# EasyEDA Pro project bitMan_2025-12-16.epro

# Schematic Top
Board Name: Board1; Create Date: 2025-11-07; Page Name: Top; Project Name: BitTree; Schematic Name: Top; Update Date: 2025-11-18; Company: bitaggregat.de; Drawn: TR; Page Size: A4; Reviewed: TR; Version: V1.0
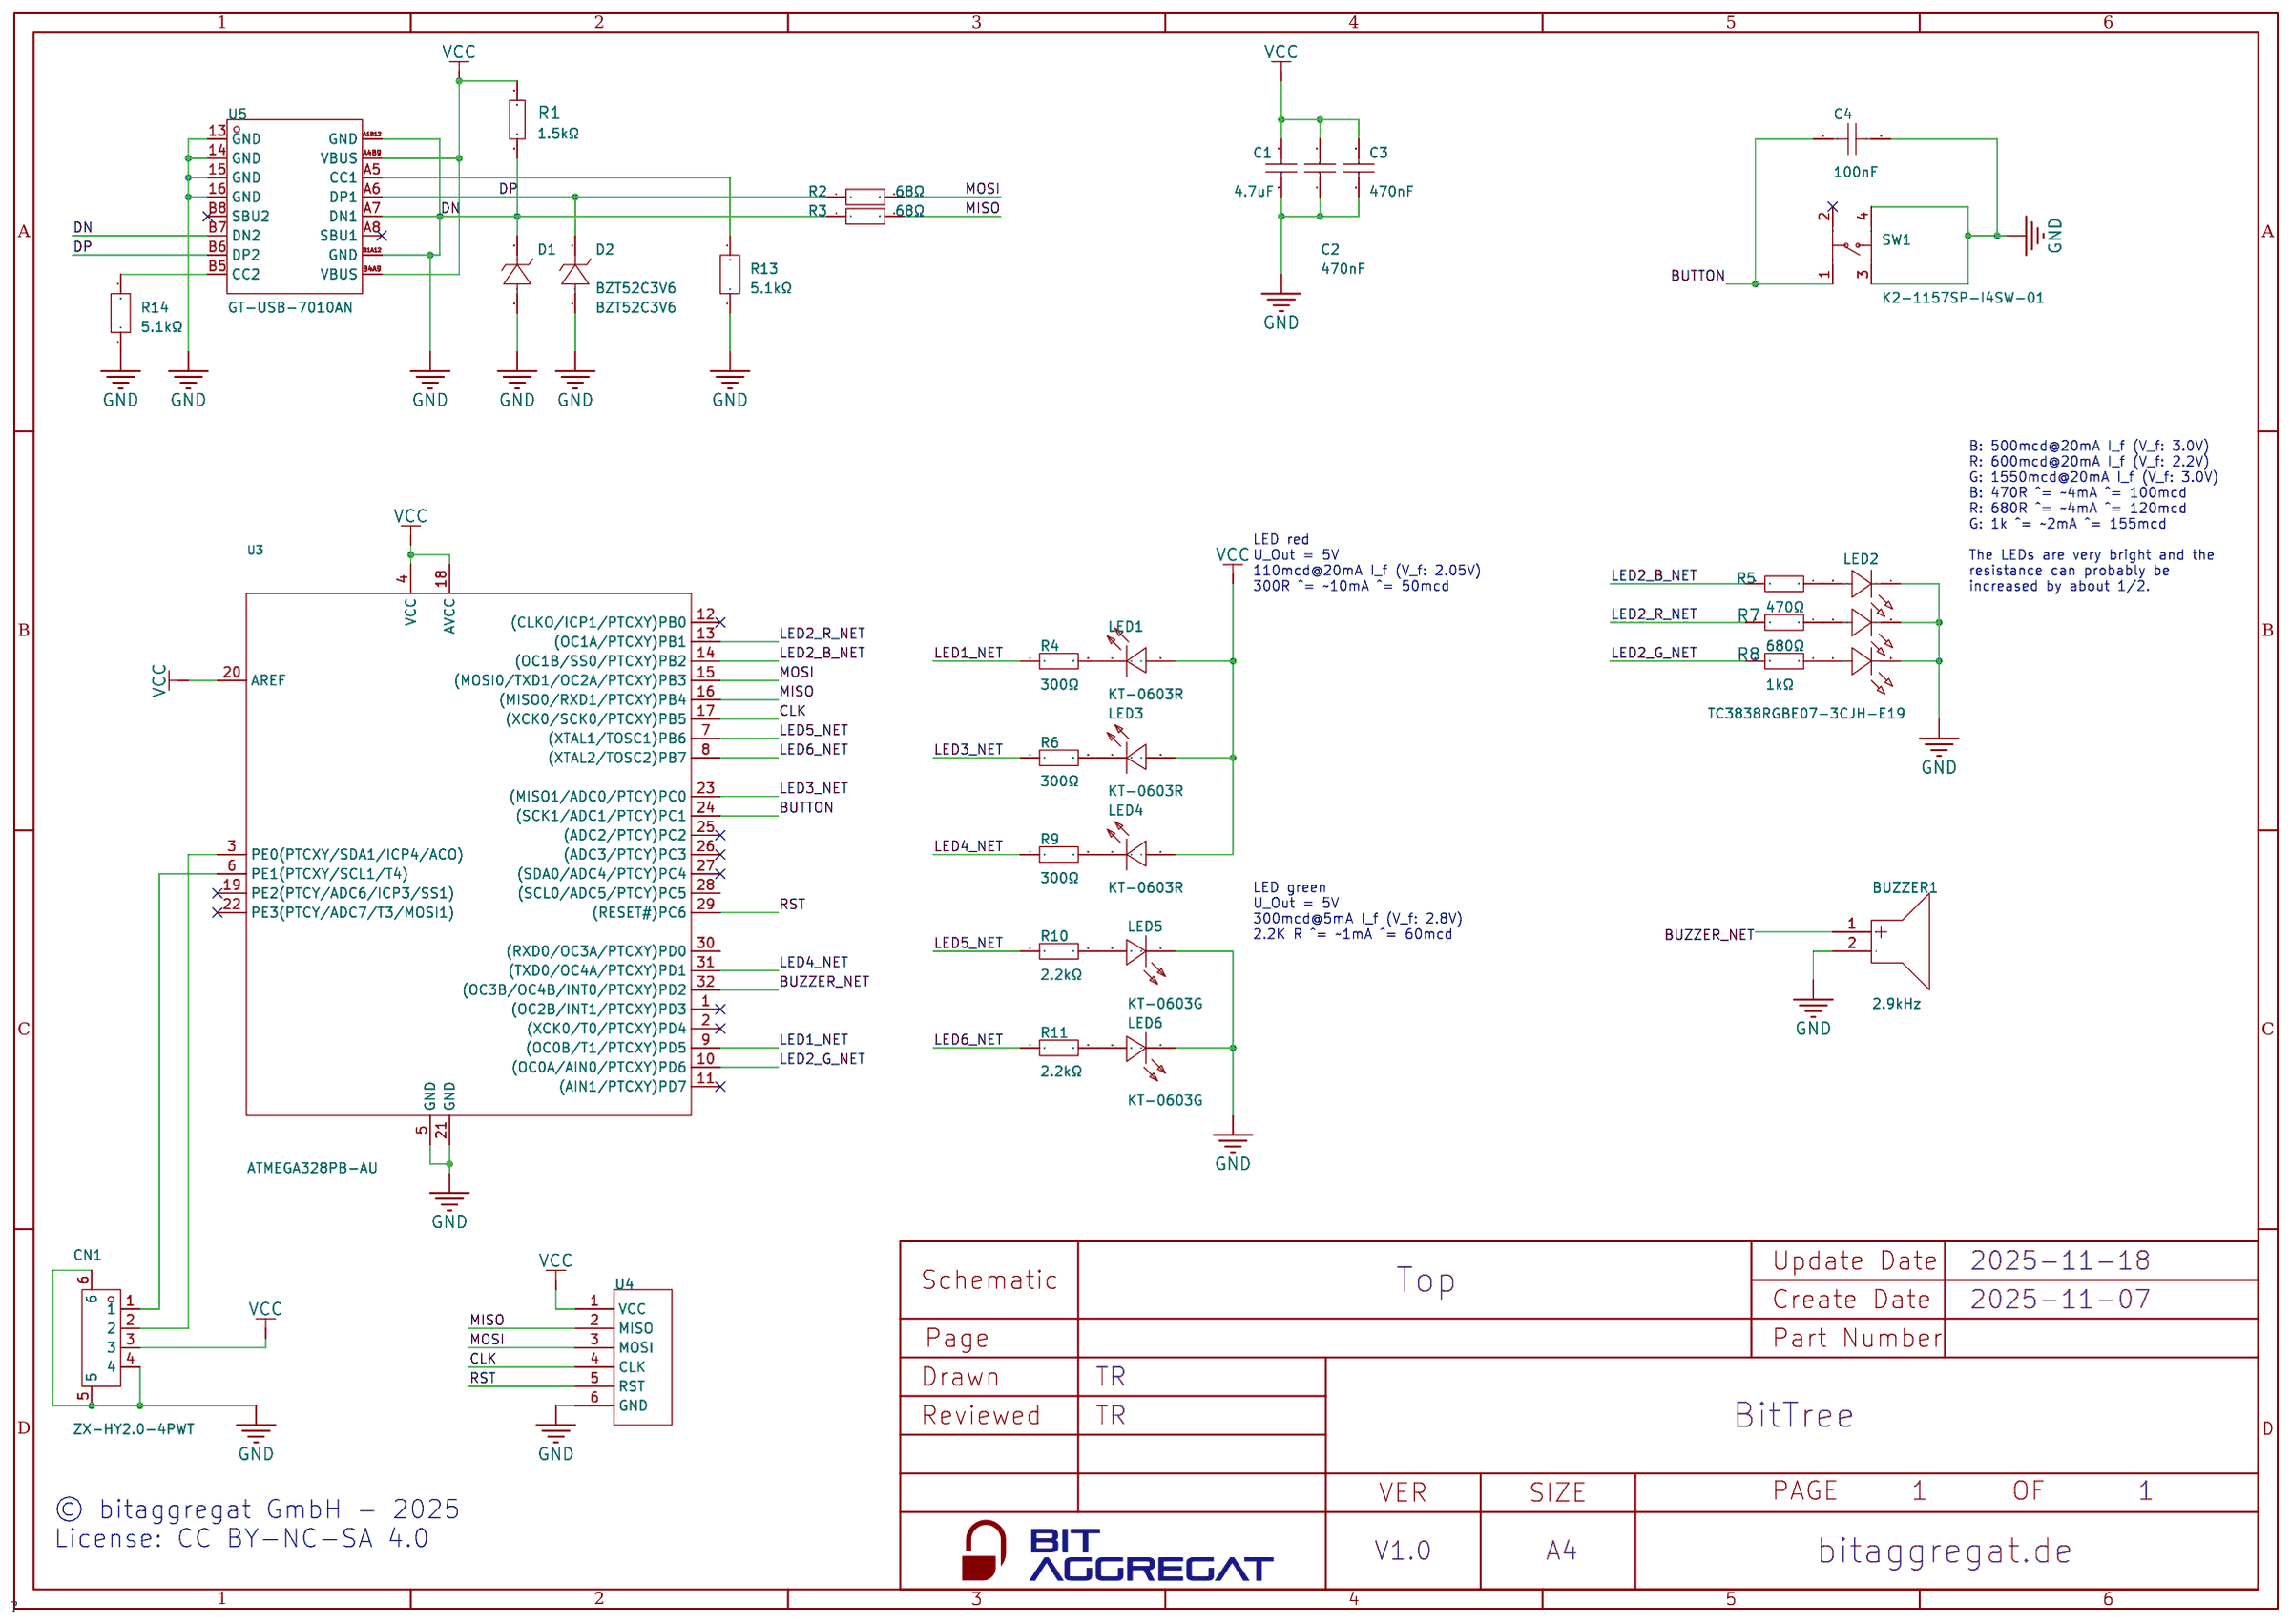
[diagram p0: schematic sheet]

## Parts
BUZZER1  2.9kHz  [BUZ-TH_BD9.0-P5.00-D0.6-L-FD]
C1  4.7uF  [C0603]
C2  470nF  [C0603]
C3  470nF  [C0603]
C4  100nF  [C0603]
CN1  ZX-HY2.0-4PWT  [CONN-SMD_4P-P2.00_ZX-HY2.0-4PWT]
D1  BZT52C3V6  [SOD-123_L2.7-W1.6-LS3.7-RD]
D2  BZT52C3V6  [SOD-123_L2.7-W1.6-LS3.7-RD]
LED1  KT-0603R  [LED0603-RD]
LED2  TC3838RGBE07-3CJH-E19  [LED-SMD_6P-L3.5-W3.5-BL]
LED3  KT-0603R  [LED0603-RD]
LED4  KT-0603R  [LED0603-RD]
LED5  KT-0603G  [LED0603-RD]
LED6  KT-0603G  [LED0603-RD]
R1  1.5kΩ  [R0603]
R2  68Ω  [R0603]
R3  68Ω  [R0603]
R4  300Ω  [R0603]
R5  470Ω  [R0603]
R6  300Ω  [R0603]
R7  680Ω  [R0603]
R8  1kΩ  [R0603]
R9  300Ω  [R0603]
R10  2.2kΩ  [R0603]
R11  2.2kΩ  [R0603]
R13  5.1kΩ  [R0603]
R14  5.1kΩ  [R0603]
SW1  K2-1157SP-I4SW-01  [SW-SMD_4P-L6.2-W6.2-P4.50-LS8.6]
U3  ATMEGA328PB-AU  [TQFP-32_L7.0-W7.0-P0.80-LS9.0-BL]
U4  -  [ProgrammingHeader]  (no BOM)
U5  GT-USB-7010AN  [USB-SMD_GT-USB-7010AN]

## Library data of the parts
BUZZER1 = Cy-9055-5029: Oscillator Circuit:有源(内含驱动线路) Technology Type:电磁式 Operating Voltage:4V~7V Operating Voltage:4V~7V Frequency:2.9kHz Sound Pressure Level (SPL):85dB@5V,10cm Diameter (φD):9mm Height:6mm; LCSC Part Name: 电磁式有源蜂鸣器; Supplier Part: C200211; Manufacturer: CY(超音); Supplier Footprint: 插件,D=9mm; JLCPCB Part Class: Extended Part; Datasheet: https://atta.szlcsc.com/upload/public/pdf/source/20180420/C200211_A81316451996AD52A4D9A06CCBA2DFC8.pdf; Supplier: LCSC; Oscillator Circuit: 有源(内含驱动线路); Technology Type: 电磁式; Operating Voltage: 4V~7V; Sound Pressure Level (SPL): 85dB@5V,10cm; Diameter (φD): 9mm; Height: 6mm
C1 = CL10A475KO8NNNC: Capacitance: Tolerance:±10% Tolerance:±10% Voltage Rated: Temperature Coefficient:; LCSC Part Name: 4.7uF ±10% 16V; Supplier Part: C19666; Manufacturer: SAMSUNG(三星); Supplier Footprint: 0603; JLCPCB Part Class: Basic Part; Datasheet: https://atta.szlcsc.com/upload/public/pdf/source/20160218/1457707763339.pdf; Supplier: LCSC; Tolerance: ±10%
C2 C3 = CL10B474KA8NNNC: Capacitance: Tolerance:±10% Tolerance:±10% Voltage Rated: Temperature Coefficient:; LCSC Part Name: 470nF ±10% 25V; Supplier Part: C1623; Manufacturer: SAMSUNG(三星); Supplier Footprint: 0603; JLCPCB Part Class: Basic Part; Datasheet: https://atta.szlcsc.com/upload/public/pdf/source/20160218/1457707763339.pdf; Supplier: LCSC; Tolerance: ±10%
C4 = CC0603KRX7R9BB104: Capacitance:100nF Tolerance:±10% Tolerance:±10% Voltage Rating:50V Temperature Coefficient:X7R; LCSC Part Name: 100nF ±10% 50V; Supplier Part: C14663; Manufacturer: YAGEO(国巨); Supplier Footprint: 0603; JLCPCB Part Class: Basic Part; Datasheet: https://item.szlcsc.com/datasheet/CC0603KRX7R9BB104/15331.html; Supplier: LCSC; Tolerance: ±10%; Voltage Rating: 50V; Temperature Coefficient: X7R
CN1 = ZX-HY2.0-4PWT: Pins Structure:1x4P Pitch:2mm Mounting Type:Surface Mount, Right Angle Reference Series:HY Number of Pins:4P Number of Rows:1 Number of PINs Per Row:4 Row Spacing:- Current Rating:2A Contact Material:Brass Contact Plating:Tin Operating Temperature:-25℃~+8; LCSC Part Name: 1x4P 间距:2mm 卧贴 系列:HY; Supplier Part: C7429571; Manufacturer: Megastar(兆星); Supplier Footprint: SMD,P=2mm,卧贴; JLCPCB Part Class: Extended Part; Datasheet: https://item.szlcsc.com/datasheet/ZX-HY2.0-4PWT/8427488.html; Supplier: LCSC; Pins Structure: 1x4P; Pitch: 2mm; Mounting Type: Surface Mount, Right Angle; Reference Series: HY; Number of Pins: 4P; Number of Rows: 1; Number of PINs Per Row: 4; Current Rating: 2A; Contact Material: Brass; Contact Plating: Tin; Operating Temperature: -25℃~+85℃; Supplementary Features: Auxiliary Solder Pin; Color: Beige; Z-Height of the Board: 5.2mm; X-Length of Bottom Edge on Board (Spacing Line): 12mm; Y-Width of Bottom Edge on Board: 10.5mm
D1 D2 = BZT52C3V6_C19077397: Diode Configuration:Independent Zener Voltage(Nom):3.6V Reverse Leakage Current (Ir):5uA@1.0V Zener Voltage(Range):3.42V~3.78V Zener Voltage(Range):3.42V~3.78V Pd - Power Dissipation:350mW Impedance(Zzt):90Ω Impedance(Zzk):600Ω Operating Junction Temperat; LCSC Part Name: 表面贴装齐纳二极管; Supplier Part: C19077397; Manufacturer: R+O(宏嘉诚); Supplier Footprint: SOD-123; JLCPCB Part Class: Extended Part; Datasheet: https://item.szlcsc.com/datasheet/BZT52C3V6/20275482.html; Supplier: LCSC; Diode Configuration: Independent; Zener Voltage (Nom): 3.6V; Reverse Leakage Current (Ir): 5uA@1.0V; Zener Voltage (Range): 3.42V~3.78V; Power Dissipation: 500mW; Zener Impedance (Zzt): 90Ω; Zener Voltage(Nom): 3.6V; Zener Voltage(Range): 3.42V~3.78V; Pd - Power Dissipation: 350mW; Impedance(Zzt): 90Ω; Impedance(Zzk): 600Ω; Operating Junction Temperature Range: -55℃~+150℃
LED1 LED3 LED4 = KT-0603R: Emitted Color:Red Power Dissipation:- Forward Current:- Dominant Wavelength:- Dominant Wavelength:- Peak Wavelength:- Diode Configuration:- Lens Color:- Color Temperature:- Color Temperature:- Viewing Angle:- Mounting Sytle:- Operating Temperature:-40℃~+8; LCSC Part Name: 0603 红灯 高亮; Supplier Part: C2286; Manufacturer: KENTO; Supplier Footprint: 0603; JLCPCB Part Class: Basic Part; Datasheet: https://atta.szlcsc.com/upload/public/pdf/source/20160616/1466072038404.pdf; Supplier: LCSC; Emitted Color: Red; Operating Temperature: -40℃~+85℃
LED2 = TC3838RGBE07-3CJH-E19: LCSC Part Name: RGB三色; Supplier Part: C784547; Manufacturer: TCWIN(天成); Supplier Footprint: SMD3535; JLCPCB Part Class: Extended Part; Datasheet: https://atta.szlcsc.com/upload/public/pdf/source/20230731/32820CE5D5D80E19C372DEF700D68815.pdf; Supplier: LCSC
LED5 LED6 = KT-0603G: Illumination Color:Emerald Green Voltage - Forward(Vf):3.1V Voltage - Forward(Vf):3.1V Power(Watts):100mW Forward Current:5mA Wavelength - Dominant:513nm~528nm Wavelength - Dominant:513nm~528nm Peak Wavelength:525nm Lens Color:Water Clear Luminous Intensi; LCSC Part Name: 0603 翠绿 高亮; Supplier Part: C12624; Manufacturer: KENTO; Supplier Footprint: 0603; JLCPCB Part Class: Extended Part; Datasheet: https://item.szlcsc.com/datasheet/KT-0603G/13258.html; Supplier: LCSC; Illumination Color: Emerald Green; Voltage - Forward(Vf): 3.1V; Power(Watts): 100mW; Forward Current: 5mA; Wavelength - Dominant: 513nm~528nm; Peak Wavelength: 525nm; Lens Color: Water Clear; Luminous Intensity: 430mcd; Viewing Angle: 120°; Operating Temperature: -40℃~+85℃
R1 = 0603WAF1501T5E: Type:Thick Film Resistors Resistance:1.5kΩ Tolerance:±1% Tolerance:±1% Power(Watts): Overload Voltage (Max): Temperature Coefficient:±100ppm/℃ Temperature Coefficient:±100ppm/℃ Operating Temperature Range:-55℃~+155℃ Operating Temperature Range:-55℃~+155℃; LCSC Part Name: 1.5kΩ ±1% 100mW 厚膜电阻; Supplier Part: C22843; Manufacturer: UNI-ROYAL(厚声); Supplier Footprint: 0603; JLCPCB Part Class: Basic Part; Datasheet: https://atta.szlcsc.com/upload/public/pdf/source/20200306/C422600_1E6D84923E4A46A82E41ADD87F860B5C.pdf; Supplier: LCSC; Type: Thick Film Resistors; Tolerance: ±1%; Temperature Coefficient: ±100ppm/℃; Operating Temperature Range: -55℃~+155℃
R2 R3 = 0603WAF680JT5E: Type:Thick Film Resistors Resistance:68Ω Tolerance:±1% Tolerance:±1% Power(Watts): Overload Voltage (Max): Temperature Coefficient:±100ppm/℃ Temperature Coefficient:±100ppm/℃ Operating Temperature Range:-55℃~+155℃ Operating Temperature Range:-55℃~+155℃; LCSC Part Name: 68Ω ±1% 100mW 厚膜电阻; Supplier Part: C27592; Manufacturer: UNI-ROYAL(厚声); Supplier Footprint: 0603; JLCPCB Part Class: Extended Part; Datasheet: https://atta.szlcsc.com/upload/public/pdf/source/20200306/C422600_1E6D84923E4A46A82E41ADD87F860B5C.pdf; Supplier: LCSC; Type: Thick Film Resistors; Tolerance: ±1%; Temperature Coefficient: ±100ppm/℃; Operating Temperature Range: -55℃~+155℃
R4 R6 R9 = 0603WAF3000T5E: Type:Thick Film Resistor Resistance:300Ω Tolerance:±1% Tolerance:±1% Power(Watts):100mW Voltage-Supply(Max):75V Temperature Coefficient:±100ppm/℃ Temperature Coefficient:±100ppm/℃ Operating Temperature:-55℃~+155℃ Operating Temperature:-55℃~+155℃; LCSC Part Name: 300Ω ±1% 100mW 厚膜电阻; Supplier Part: C23025; Manufacturer: UNI-ROYAL(厚声); Supplier Footprint: 0603; JLCPCB Part Class: Basic Part; Datasheet: https://item.szlcsc.com/datasheet/0603WAF3000T5E/23752.html; Supplier: LCSC; Type: Thick Film Resistor; Tolerance: ±1%; Power(Watts): 100mW; Voltage-Supply(Max): 75V; Temperature Coefficient: ±100ppm/℃; Operating Temperature: -55℃~+155℃
R5 = 0603WAF4700T5E: Type:Thick Film Resistors Resistance: Tolerance:±1% Tolerance:±1% Power(Watts): Overload Voltage (Max): Temperature Coefficient:±100ppm/℃ Temperature Coefficient:±100ppm/℃ Operating Temperature Range:-55℃~+155℃ Operating Temperature Range:-55℃~+155℃; LCSC Part Name: 470Ω ±1% 100mW 厚膜电阻; Supplier Part: C23179; Manufacturer: UNI-ROYAL(厚声); Supplier Footprint: 0603; JLCPCB Part Class: Basic Part; Datasheet: https://atta.szlcsc.com/upload/public/pdf/source/20200306/C422600_1E6D84923E4A46A82E41ADD87F860B5C.pdf; Supplier: LCSC; Type: Thick Film Resistors; Tolerance: ±1%; Temperature Coefficient: ±100ppm/℃; Operating Temperature Range: -55℃~+155℃
R7 = 0603WAF6800T5E: Type:Thick Film Resistors Resistance: Tolerance:±1% Tolerance:±1% Power(Watts): Overload Voltage (Max): Temperature Coefficient:±100ppm/℃ Temperature Coefficient:±100ppm/℃ Operating Temperature Range:-55℃~+155℃ Operating Temperature Range:-55℃~+155℃; LCSC Part Name: 680Ω ±1% 100mW 厚膜电阻; Supplier Part: C23228; Manufacturer: UNI-ROYAL(厚声); Supplier Footprint: 0603; JLCPCB Part Class: Basic Part; Datasheet: https://atta.szlcsc.com/upload/public/pdf/source/20200306/C422600_1E6D84923E4A46A82E41ADD87F860B5C.pdf; Supplier: LCSC; Type: Thick Film Resistors; Tolerance: ±1%; Temperature Coefficient: ±100ppm/℃; Operating Temperature Range: -55℃~+155℃
R8 = 0603WAF1001T5E: Type:Thick Film Resistors Resistance:1kΩ Tolerance:±1% Tolerance:±1% Power(Watts): Overload Voltage (Max): Temperature Coefficient:±100ppm/℃ Temperature Coefficient:±100ppm/℃ Operating Temperature Range:-55℃~+155℃ Operating Temperature Range:-55℃~+155℃; LCSC Part Name: 1kΩ ±1% 100mW 厚膜电阻; Supplier Part: C21190; Manufacturer: UNI-ROYAL(厚声); Supplier Footprint: 0603; JLCPCB Part Class: Basic Part; Datasheet: https://atta.szlcsc.com/upload/public/pdf/source/20200306/C422600_1E6D84923E4A46A82E41ADD87F860B5C.pdf; Supplier: LCSC; Type: Thick Film Resistors; Tolerance: ±1%; Temperature Coefficient: ±100ppm/℃; Operating Temperature Range: -55℃~+155℃
R10 R11 = 0603WAF2201T5E_C4190: Type:Thick Film Resistors Resistance:2.2kΩ Tolerance:±1% Tolerance:±1% Power(Watts): Overload Voltage (Max): Temperature Coefficient:±100ppm/℃ Temperature Coefficient:±100ppm/℃ Operating Temperature Range:-55℃~+155℃ Operating Temperature Range:-55℃~+155℃; LCSC Part Name: 2.2kΩ ±1% 100mW 厚膜电阻; Supplier Part: C4190; Manufacturer: UNI-ROYAL(厚声); Manufacturer Part: 0603WAF2201T5E; Supplier Footprint: 0603; JLCPCB Part Class: Basic Part; Datasheet: https://atta.szlcsc.com/upload/public/pdf/source/20200306/C422600_1E6D84923E4A46A82E41ADD87F860B5C.pdf; Supplier: LCSC; Type: Thick Film Resistors; Tolerance: ±1%; Temperature Coefficient: ±100ppm/℃; Operating Temperature Range: -55℃~+155℃
R13 R14 = FRC0603F5101TS: Type:Thick Film Resistor Resistance:5.1kΩ Tolerance:±1% Tolerance:±1% Power(Watts):100mW Voltage-Supply(Max):75V Temperature Coefficient:±100ppm/℃ Temperature Coefficient:±100ppm/℃ Operating Temperature:-55℃~+155℃ Operating Temperature:-55℃~+155℃; LCSC Part Name: 5.1kΩ ±1% 100mW 厚膜电阻; Supplier Part: C2907044; Manufacturer: FOJAN(富捷); Supplier Footprint: 0603; JLCPCB Part Class: Extended Part; Supplier: LCSC; Type: Thick Film Resistor; Tolerance: ±1%; Power(Watts): 100mW; Voltage-Supply(Max): 75V; Temperature Coefficient: ±100ppm/℃; Operating Temperature: -55℃~+155℃
SW1 = K2-1157SP-I4SW-01: Circuit:- Self Lock / No Lock:- Actuator Style:Round Button IP Rating:- Mounting Type:Surface Mount,Vertical Contact Current:50mA Voltage Rating:12V Actuator/Cap Color:Red With Lamp:Without Termination Style:Gull Wing Operating Force:2.5N Operating Temper; LCSC Part Name: 6.4x6.2x3.7红柄开关; Supplier Part: C2909692; Manufacturer: 韩国韩荣; Supplier Footprint: SMD; JLCPCB Part Class: Extended Part; Datasheet: https://item.szlcsc.com/datasheet/K2-1157SP-I4SW-01/3187750.html; Supplier: LCSC; Actuator Style: Round Button; Mounting Type: Surface Mount,Vertical; Contact Current: 50mA; Voltage Rating: 12V; Actuator/Cap Color: Red; With Lamp: Without; Termination Style: Gull Wing; Operating Force: 2.5N; Operating Temperature: -25℃~+80℃; Life: 100,000 Cycles
U3 = ATMEGA328PB-AU: CPU Core:AVR CPU Maximum Speed:20MHz Program Storage Size:32KB Program Memory Type:FLASH Number of I/O:27 ADC (Bit):10bit Voltage - Supply:1.8V~5.5V Voltage - Supply:1.8V~5.5V Applications:-; Supplier Part: C132230; Manufacturer: MICROCHIP(美国微芯); Supplier Footprint: TQFP-32(7x7); JLCPCB Part Class: Extended Part; Datasheet: https://item.szlcsc.com/datasheet/ATMEGA328PB-AU/143529.html; Supplier: LCSC; CPU Core: AVR; CPU Maximum Speed: 20MHz; Program Storage Size: 32KB; Program Memory Type: FLASH; Number of I/O: 27; ADC (Bit): 10bit; Voltage - Supply: 1.8V~5.5V
U4 = ProgrammingHeader
U5 = GT-USB-7010AN: Connector Type:Type-C Standard:USB 2.0 Gender:Female Mounting Style:卧贴 Number of Contacts:16P Number of Ports:1 Current Rating - Power (Max):5A Contact Material:高导铜 Contact Plating:Gold Operating Temperature Range:-40℃~+85℃ Operating Temperature Range:-40; LCSC Part Name: Type-C 母 卧贴 黑色; Supplier Part: C963370; Manufacturer: G-Switch(品赞); Supplier Footprint: SMD; JLCPCB Part Class: Extended Part; Datasheet: https://atta.szlcsc.com/upload/public/pdf/source/20231219/A53A193191E7DF39BB7DE19828A2E6A3.pdf; Supplier: LCSC; Connector Type: Type-C; Standard: USB 2.0; Gender: Female; Mounting Style: 卧贴; Number of Contacts: 16P; Number of Ports: 1; Current Rating - Power (Max): 5A; Contact Material: 高导铜; Contact Plating: Gold; Operating Temperature Range: -40℃~+85℃

## Nets
GND: BUZZER1.2(-) C1.1 C2.1 C3.1 C4.2 CN1.4 CN1.5 CN1.6 D1.2(A) D2.2(A) LED2.4(-) LED2.5(-) LED2.6(-) LED5.1(K) LED6.1(K) R13.1 R14.1 SW1.3 SW1.4 U3.5(GND) U3.21(GND) U4.6(GND) U5.13(GND) U5.14(GND) U5.15(GND) U5.16(GND) U5.A1B12(GND) U5.B1A12(GND)
VCC: C1.2 C2.2 C3.2 CN1.3 LED1.2(A) LED3.2(A) LED4.2(A) R1.2 U3.4(VCC) U3.18(AVCC) U3.20(AREF) U4.1(VCC) U5.A4B9(VBUS) U5.B4A9(VBUS)
BUTTON: C4.1 SW1.1 U3.24((SCK1/ADC1/PTCY)PC1)
BUZZER_NET: BUZZER1.1(+) U3.32((OC3B/OC4B/INT0/PTCXY)PD2)
CLK: U3.17((XCK0/SCK0/PTCXY)PB5) U4.4(CLK)
DN: D1.1(K) R1.1 R3.1 U5.A7(DN1) U5.B7(DN2)
DP: D2.1(K) R2.1 U5.A6(DP1) U5.B6(DP2)
LED1_NET: R4.1 U3.9((OC0B/T1/PTCXY)PD5)
LED2_B_NET: R5.2 U3.14((OC1B/SS0/PTCXY)PB2)
LED2_G_NET: R8.2 U3.10((OC0A/AIN0/PTCXY)PD6)
LED2_R_NET: R7.2 U3.13((OC1A/PTCXY)PB1)
LED3_NET: R6.1 U3.23((MISO1/ADC0/PTCY)PC0)
LED4_NET: R9.1 U3.31((TXD0/OC4A/PTCXY)PD1)
LED5_NET: R10.1 U3.7((XTAL1/TOSC1)PB6)
LED6_NET: R11.1 U3.8((XTAL2/TOSC2)PB7)
MISO: R3.2 U3.16((MISO0/RXD1/PTCXY)PB4) U4.2(MISO)
MOSI: R2.2 U3.15((MOSI0/TXD1/OC2A/PTCXY)PB3) U4.3(MOSI)
RST: U3.29((RESET#)PC6) U4.5(RST)
$1N1666: LED2.2(+) R7.1
$1N1705: LED2.3(+) R5.1
$1N1857: LED2.1(+) R8.1
$1N3584: LED1.1(K) R4.2
$1N3623: LED3.1(K) R6.2
$1N3662: LED4.1(K) R9.2
$1N3701: LED5.2(A) R10.2
$1N3740: LED6.2(A) R11.2
$1N12045: R14.2 U5.B5(CC2)
$1N12054: R13.2 U5.A5(CC1)
$1N16109: CN1.1 U3.6(PE1(PTCXY/SCL1/T4))
$1N16126: CN1.2 U3.3(PE0(PTCXY/SDA1/ICP4/ACO))

Not connected (* = marked no-connect by the designer): SW1 2*; U3 1((OC2B/INT1/PTCXY)PD3)* 2((XCK0/T0/PTCXY)PD4)* 11((AIN1/PTCXY)PD7)* 12((CLKO/ICP1/PTCXY)PB0)* 19(PE2(PTCY/ADC6/ICP3/SS1))* 22(PE3(PTCY/ADC7/T3/MOSI1))* 25((ADC2/PTCY)PC2)* 26((ADC3/PTCY)PC3)* 27((SDA0/ADC4/PTCY)PC4)* 28((SCL0/ADC5/PTCY)PC5) 30((RXD0/OC3A/PTCXY)PD0); U5 A8(SBU1)* B8(SBU2)*

## Notes on the sheet
- LED red
  U_Out = 5V
  110mcd@20mA I_f (V_f: 2.05V)
  300R ^= ~10mA ^= 50mcd
- B: 500mcd@20mA I_f (V_f: 3.0V)
  R: 600mcd@20mA I_f (V_f: 2.2V)
  G: 1550mcd@20mA I_f (V_f: 3.0V)
  B: 470R ^= ~4mA ^= 100mcd
  R: 680R ^= ~4mA ^= 120mcd
  G: 1k ^= ~2mA ^= 155mcd
  The LEDs are very bright and the
  resistance can probably be
  increased by about 1/2.
- LED green
  U_Out = 5V
  300mcd@5mA I_f (V_f: 2.8V)
  2.2K R ^= ~1mA ^= 60mcd
- © bitaggregat GmbH - 2025
  License: CC BY-NC-SA 4.0

# Board PCB3
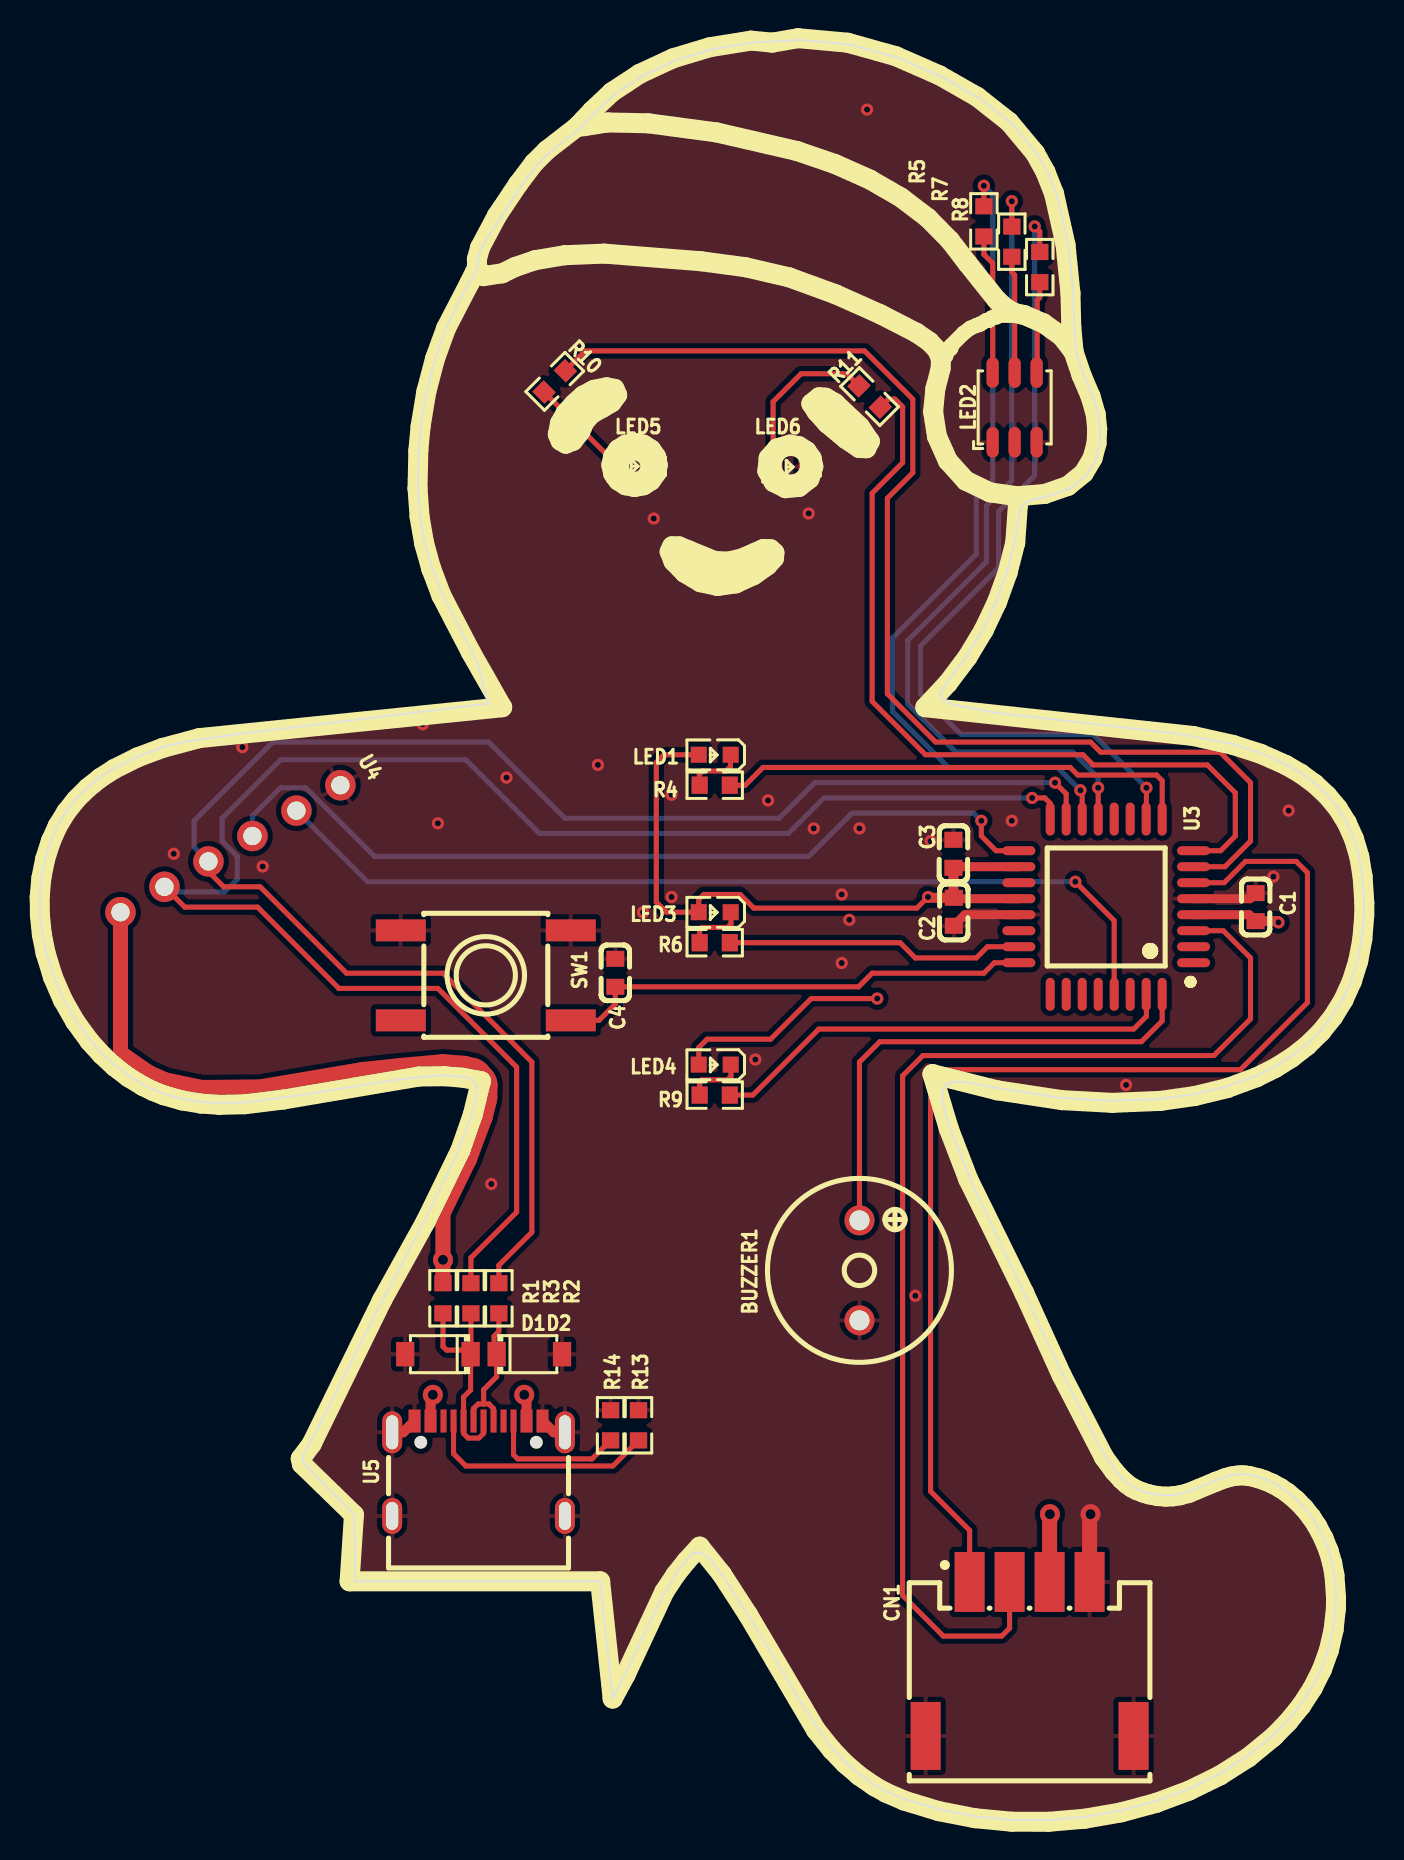
[diagram p1: board, top side]
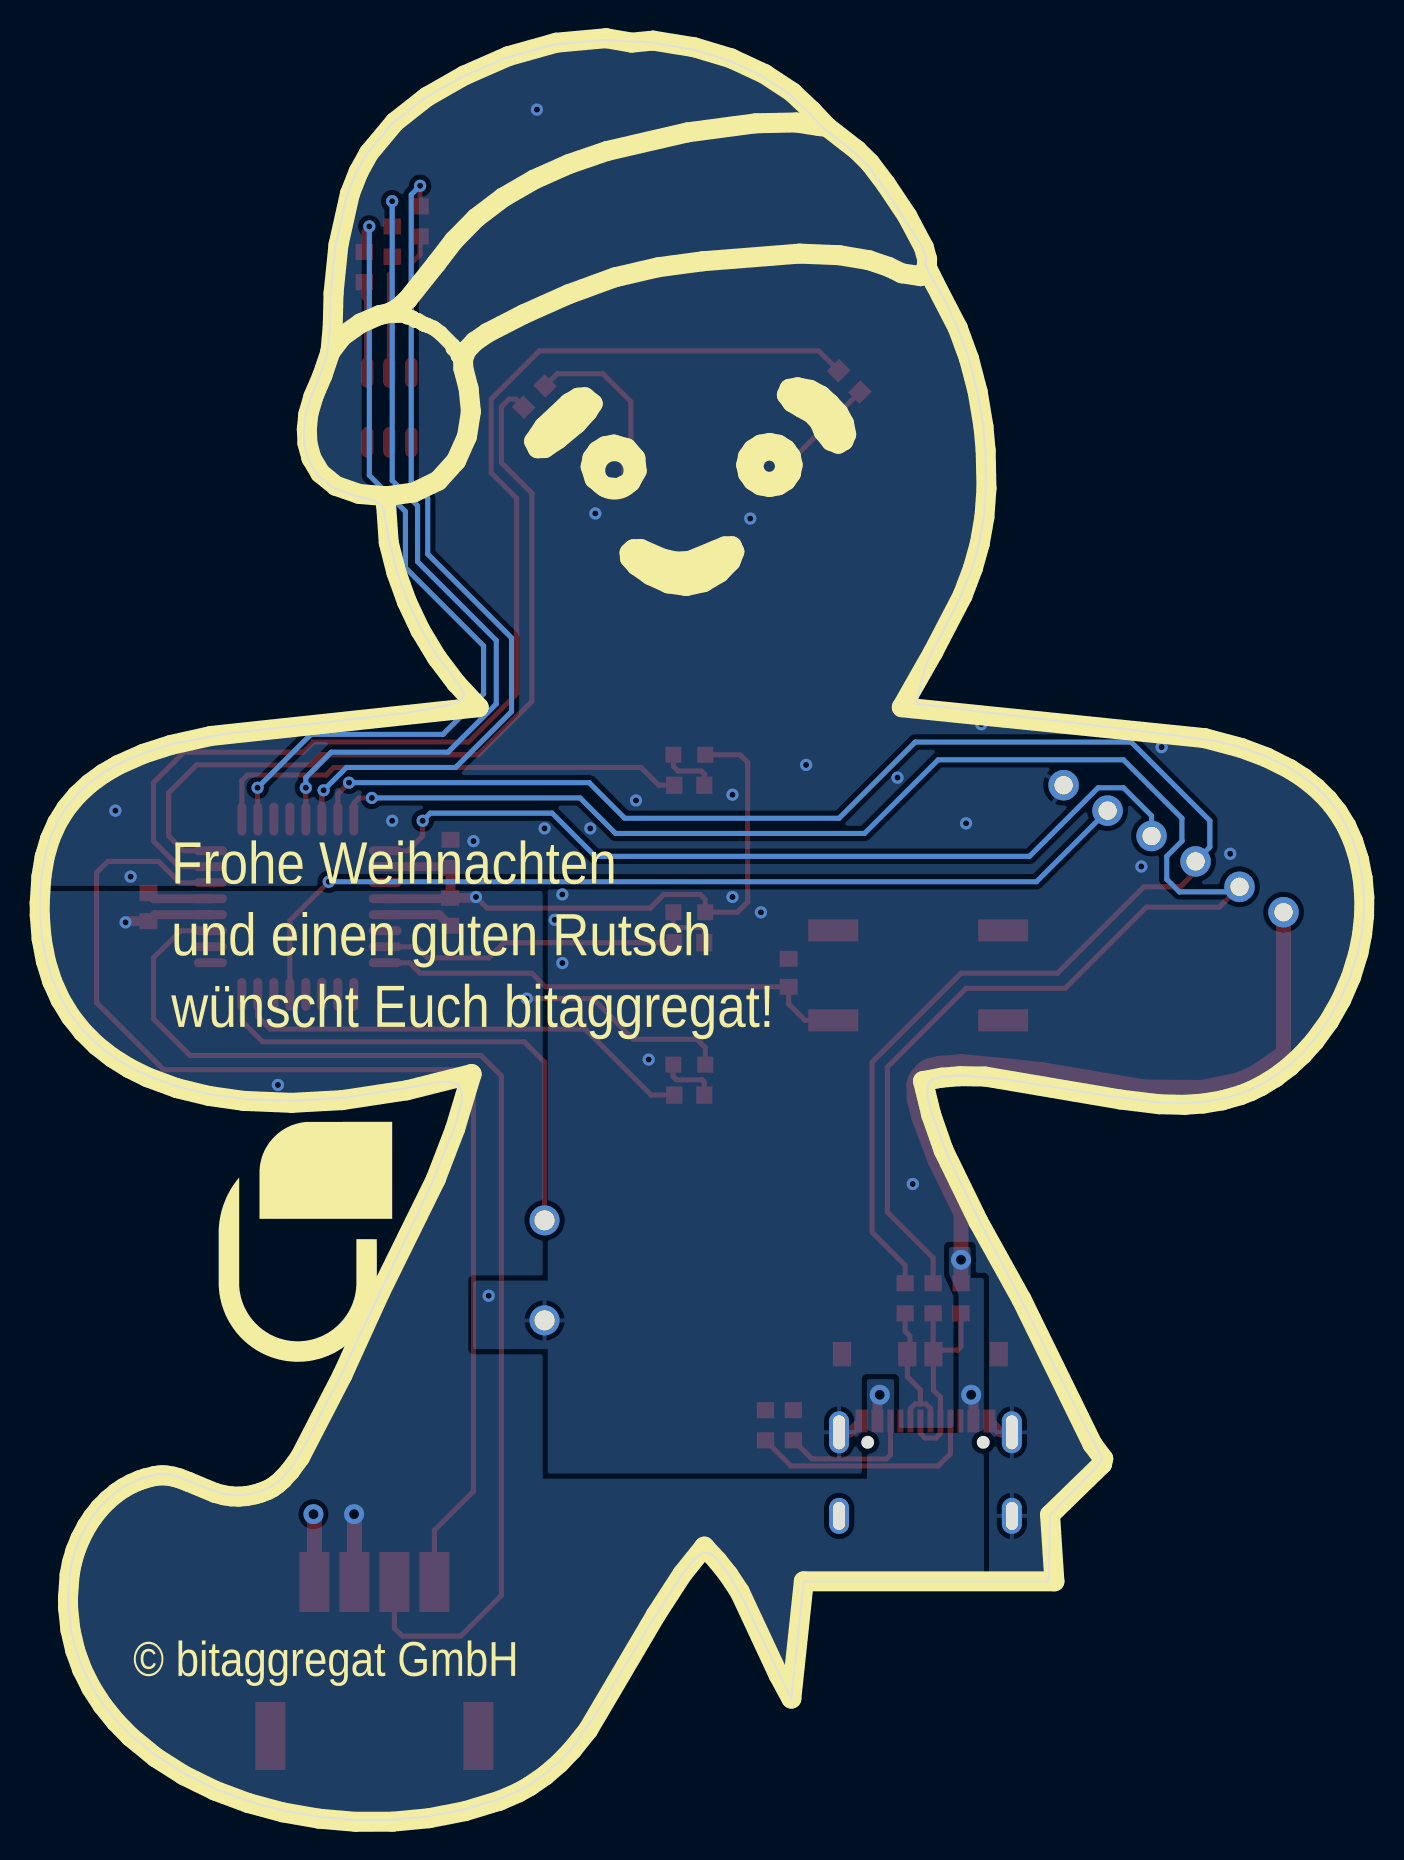
[diagram p2: board, bottom side, seen from below]

Outline 66.21 x 89 mm; copper layers: Top Layer, Bottom Layer. Coordinates in mm from the lower left corner of the outline.
Outline path: 0,46.22 0.08,47.16 0.27,48.09 0.55,48.98 0.9,49.76 1.32,50.46 1.82,51.08 2.39,51.65 3.03,52.16 3.79,52.64 4.89,53.18 6.23,53.67 7.34,53.94 10.19,54.34 22.41,55.82 21.91,57.76 21.57,58.45 20.24,61.03 19.59,62.63 19.23,63.9 19,65.23 18.9,66.72 18.93,68.42 19.06,69.83 19.34,71.47 19.77,73.11 20.33,74.65 21.01,76.08 21.79,77.43 21.95,77.87 21.88,78.07 22.13,78.72 24.07,81.71 24.86,82.76 25.51,83.41 27,84.57 27.77,85.38 28.75,86.3 30.14,87.22 31.82,88 33.65,88.55 35.71,88.88 38.06,89 40.55,88.78 42.95,88.1 45.14,87.14 47.03,86.06 48.62,84.81 49.91,83.26 50.43,82.32 50.87,81.23 51.44,78.68 51.68,76.26 51.73,74.56 51.84,73.32 52.24,72.15 52.69,71.08 52.95,70.21 53.02,69.46 52.99,68.74 52.79,68.01 52.35,67.26 51.56,66.62 50.47,66.21 49.51,65.99 49.09,65.69 49.02,65.46 48.75,63.94 48.37,62.44 47.84,60.98 47.17,59.56 46.35,58.21 45.38,56.92 45,56.32 45.11,56.04 45.59,55.79 47.81,55.36 51,55 56.89,54.31 59.56,53.82 61.02,53.36 62.21,52.84 63.04,52.37 63.73,51.86 64.35,51.29 64.88,50.64 65.34,49.92 65.7,49.11 65.96,48.21 66.13,47.18 66.21,46.03 66.21,45.2 66.11,44.12 65.9,43.02 65.59,42.01 65.17,41.09 64.66,40.25 64.05,39.48 63.36,38.8 62.59,38.2 61.75,37.67 60.75,37.19 59.34,36.68 57.73,36.29 55.92,36.04 53.61,35.96 50.98,36.12 47.87,36.6 46.33,36.89 45.73,36.91 45.31,36.77 45.12,36.43 45.13,35.92 45.48,34.66 46.73,31.57 49.06,26.69 51.13,22.31 52.94,18.76 53.7,17.56 54.07,17.13 54.35,16.88 54.6,16.69 54.86,16.56 55.16,16.44 55.48,16.35 55.88,16.27 56.28,16.24 56.65,16.25 57.03,16.31 57.61,16.49 58.65,16.91 59.24,17.14 59.57,17.23 59.85,17.28 60.08,17.29 60.29,17.28 60.54,17.24 60.92,17.15 61.26,17.04 61.64,16.87 62.03,16.66 62.4,16.4 62.82,16.05 63.22,15.64 63.57,15.2 63.88,14.72 64.18,14.14 64.43,13.52 64.61,12.91 64.73,12.23 64.8,11.28 64.79,10.55 64.67,9.58 64.44,8.56 64.09,7.59 63.63,6.67 63.07,5.8 62.42,4.99 61.6,4.18 60.4,3.21 58.99,2.32 57.45,1.56 55.79,0.94 54.06,0.47 52.27,0.16 50.43,0 48.59,0.01 46.76,0.18 44.97,0.53 43.35,1.01 42.36,1.42 41.7,1.78 40.97,2.3 40.26,2.91 39.57,3.62 38.37,5.36 35.76,9.7 34.13,12.25 33.55,12.99 33.06,13.39 32.67,13.33 32.35,13.02 31.78,12.3 30.99,10.92 29.5,7.82 28.64,6.07 28.01,11.93 15.77,11.93 15.7,15.26 13.52,17.48 13.14,17.96 13.14,18.21 14.08,19.94 16.89,25.53 19.21,29.93 20.84,33.25 21.61,35.31 21.82,36.14 21.83,36.76 21.57,37.06 21.14,37.16 20.15,37.24 18.03,37.05 12.99,36.24 10.36,35.89 9.03,35.84 8.04,35.9 7.1,36.06 6.25,36.29 5.67,36.52 5.12,36.79 4.43,37.22 3.74,37.74 3.09,38.35 2.46,39.06 1.77,40.01 1.16,41.08 0.67,42.23 0.31,43.37 0.11,44.35 0.01,45.28 0,46.22
Stack: Top Layer 0.035mm / Dielectric1 1.51mm FR4 er 4.5 / Bottom Layer 0.035mm

## Design rules (mm)
net GND: GND
net VCC: VCC
template: JLCPCB Capability(Two Layers Board)
spacing copperThickness1oz (default): track to track 0.102, other pairs 0.152 to 0.3
spacing copperThickness2oz: track to track 0.203, other pairs 0.152 to 0.3
track width copperThickness1oz (default): min 0.127, default 0.254, max 2.54
track width copperThickness2oz: min 0.203, default 0.254, max 2.54
differential pair differentialPair (default): width min 0.127, default 0.254, max 2.54; gap min 0.152, default 0.152
via viaSize (default): diameter min 0.5, default 0.61, max 10; hole min 0.3, default 0.305, max 6.3

## Placement (name value [footprint] x y rotation side)
BUZZER1  2.9kHz  [BUZ-TH_BD9.0-P5.00-D0.6-L-FD]  40.98 27.48 270 top
C1  4.7uF  [C0603]  60.79 45.64 270 top
C2  470nF  [C0603]  45.7 45.41 90 top
C3  470nF  [C0603]  45.68 48.31 270 top
C4  100nF  [C0603]  28.77 42.36 90 top
CN1  ZX-HY2.0-4PWT  [CONN-SMD_4P-P2.00_ZX-HY2.0-4PWT]  49.49 8.05 0 top
D1  BZT52C3V6  [SOD-123_L2.7-W1.6-LS3.7-RD]  19.9 23.29 180 top
D2  BZT52C3V6  [SOD-123_L2.7-W1.6-LS3.7-RD]  24.47 23.29 0 top
LED1  KT-0603R  [LED0603-RD]  33.74 53.26 180 top
LED2  TC3838RGBE07-3CJH-E19  [LED-SMD_6P-L3.5-W3.5-BL]  48.74 70.63 0 top
LED3  KT-0603R  [LED0603-RD]  33.74 45.39 180 top
LED4  KT-0603R  [LED0603-RD]  33.74 37.77 180 top
LED5  KT-0603G  [LED0603-RD]  29.79 67.7 180 top
LED6  KT-0603G  [LED0603-RD]  37.54 67.66 180 top
R1  1.5kΩ  [R0603]  20.15 26.09 90 top
R2  68Ω  [R0603]  22.95 26.09 90 top
R3  68Ω  [R0603]  21.55 26.09 90 top
R4  300Ω  [R0603]  33.74 51.74 180 top
R5  470Ω  [R0603]  47.2 79.93 90 top
R6  300Ω  [R0603]  33.74 43.87 180 top
R7  680Ω  [R0603]  48.6 78.92 90 top
R8  1kΩ  [R0603]  50 77.65 90 top
R9  300Ω  [R0603]  33.74 36.25 180 top
R10  2.2kΩ  [R0603]  25.74 71.93 225 top
R11  2.2kΩ  [R0603]  41.49 71.17 135 top
R13  5.1kΩ  [R0603]  29.93 19.74 270 top
R14  5.1kΩ  [R0603]  28.54 19.74 270 top
SW1  K2-1157SP-I4SW-01  [SW-SMD_4P-L6.2-W6.2-P4.50-LS8.6]  22.29 42.23 180 top
U3  ATMEGA328PB-AU  [TQFP-32_L7.0-W7.0-P0.80-LS9.0-BL]  53.32 45.67 90 top
U4  -  [ProgrammingHeader]  4.02 45.39 300 top
U5  GT-USB-7010AN  [USB-SMD_GT-USB-7010AN]  21.93 17.58 0 top

## Footprints (pads in the part's own frame, mm; a bottom-side part is the same pattern mirrored in y, then rotated)
BUZ-TH_BD9.0-P5.00-D0.6-L-FD
  round 1.5 hole 1: 1(-2.5,0) 2(2.5,0)
C0603
  rect 0.8x0.9 smd: 1(-0.7,0) 2(0.7,0)
CONN-SMD_4P-P2.00_ZX-HY2.0-4PWT
  rect 1.5x3 smd: 1(-3,3.85) 2(-1,3.85) 3(1,3.85) 4(3,3.85)
  rect 1.5x3.4 smd: 5(5.2,-3.85) 6(-5.2,-3.85)
LED0603-RD
  rect 0.8x0.8 smd: 1(-0.799,0) 2(0.799,0)
LED-SMD_6P-L3.5-W3.5-BL
  oval 0.616x1.533 smd: 1(1.1,1.742) 2(0,1.742) 3(-1.1,1.742) 4(-1.1,-1.742) 5(0,-1.742) 6(1.1,-1.742)
ProgrammingHeader
  round 1.524 hole 0.914: 1(0,0) 2(0,2.54) 3(0,5.08) 4(0,7.62) 5(0,10.16) 6(0,12.7)
R0603
  rect 0.806x0.864 smd: 1(-0.753,0) 2(0.753,0)
SOD-123_L2.7-W1.6-LS3.7-RD
  rect 0.91x1.22 smd: 1(-1.635,0) 2(1.635,0)
SW-SMD_4P-L6.2-W6.2-P4.50-LS8.6
  rect 2.5x1.1 smd: 1(-4.25,2.25) 2(4.25,2.25) 3(-4.25,-2.25) 4(4.25,-2.25)
TQFP-32_L7.0-W7.0-P0.80-LS9.0-BL
  oval 0.45x1.65 smd: 1(-2.8,-4.369) 2(-2,-4.369) 3(-1.2,-4.369) 4(-0.4,-4.369) 5(0.4,-4.369) 6(1.2,-4.369) 7(2,-4.369) 8(2.8,-4.369) 17(2.8,4.369) 18(2,4.369) 19(1.2,4.369) 20(0.4,4.369) 21(-0.4,4.369) 22(-1.2,4.369) 23(-2,4.369) 24(-2.8,4.369)
  oval 1.65x0.45 smd: 9(4.381,-2.8) 10(4.381,-2) 11(4.381,-1.2) 12(4.381,-0.4) 13(4.381,0.4) 14(4.381,1.2) 15(4.381,2) 16(4.381,2.8) 25(-4.381,2.8) 26(-4.381,2) 27(-4.381,1.2) 28(-4.381,0.4) 29(-4.381,-0.4) 30(-4.381,-1.2) 31(-4.381,-2) 32(-4.381,-2.8)
USB-SMD_GT-USB-7010AN
  oval 1x2.1 hole 0.6x1.7: 13(-4.32,1.808) 14(4.32,1.808)
  oval 1x1.8 hole 0.6x1.4: 15(-4.32,-2.373) 16(4.32,-2.373)
  rect 0.6x1.15 smd: A1B12(-3.2,2.373) A4B9(-2.4,2.373) B1A12(3.2,2.373) B4A9(2.4,2.373)
  rect 0.3x1.15 smd: A5(-1.25,2.373) A6(-0.25,2.373) A7(0.25,2.373) A8(1.25,2.373) B5(1.75,2.373) B6(0.75,2.373) B7(-0.75,2.373) B8(-1.75,2.373)

## Nets
As in the schematic.

Pads without a net: SW1 2; U3 1 2 11 12 19 22 25 26 27 28 30; U5 A8 B8

## Via types
v1: diameter 0.61, hole 0.305, Top Layer to Bottom Layer, 40 vias
v2: diameter 1, hole 0.5, Top Layer to Bottom Layer, 5 vias

## Routing (per net, layer and track width the routed paths; a pad name or vN(x,y) marks a point on that pad's centre or on a via; arc(x,y) is an arc through that point)
GND: length 12.8
  Top Layer w0.45: 48.95,45.27 46.26,45.27 C2.1 ; C1.1 60.52,46.07 U3.5
  Top Layer w0.5: U5.A1B12 18.17,19.38 U5.13 ; U5.B1A12 25.7,19.38 U5.14
  Top Layer w0.75: v2(52.54,15.29) 52.49,15.24 CN1.4
  vias: v1(6.69,48.31) v1(10.12,53.65) v1(11.14,47.68) v1(19.14,54.79) v1(19.9,49.84) v1(22.57,31.8) v1(23.33,52.12) v1(27.9,52.76) v1(30.16,45.38) v1(30.69,65.08) v1(31.58,51.27) v1(31.58,46.15) v1(35.77,38.02) v1(36.41,50.98) v1(38.44,65.33) v1(38.7,49.58) v1(40.09,46.28) v1(40.09,42.85) v1(40.47,45.01) v1(40.98,49.58) v1(41.36,85.52) v1(43.78,26.21) v1(44.54,48.95) v1(48.6,49.96) v1(61.68,47.17) v1(62.44,50.47)
VCC: length 92.2
  Top Layer w0.254: LED1.2 31.2,53.26 30.82,52.88 30.82,45.9 31.33,45.39 LED3.2 32.94,46.03 33.2,46.28 35.01,46.28 35.7,45.59 43.85,45.59 v1(44.41,46.15) ; LED4.2 32.94,38.62 33.36,39.04 36.54,39.04 38.57,41.07 v1(41.87,41.07) ; 4.02,38.41 4.02,38.07 4.04,38.05
  Top Layer w0.45: 48.95,47.67 45.73,47.67 C3.2 ; 45.75,46.07 48.95,46.07 ; U3.4 60.47,45.27 C1.2
  Top Layer w0.5: v2(24.22,21.26) 24.33,21.15 U5.B4A9 ; v1(61.94,44.88) 61.87,44.94 C1.2 ; v2(19.65,21.26) 19.53,21.15 U5.A4B9 ; C2.2 44.45,46.11 v1(44.41,46.15) ; C3.2 45.68,46.13
  Top Layer w0.75: R1.2 v2(20.15,28.01) 20.15,30.31 21.44,32.96 arc(21.46,32.99) 21.47,33.02 22.24,35.08 arc(22.25,35.11) 22.26,35.15 22.47,35.97 arc(22.49,36.04) 22.49,36.12 22.51,36.74 arc(22.47,36.99) 22.34,37.2 22.08,37.5 arc(21.92,37.64) 21.72,37.72 21.29,37.82 arc(21.24,37.83) 21.19,37.84 20.2,37.91 arc(20.15,37.91) 20.09,37.91 17.97,37.72 16.09,37.52 10.99,36.65 8.09,36.63 6.27,37.01 5.45,37.38 4.17,38.26 4.02,38.41 U4.1 ; CN1.3 50.49,15.28 v2(50.51,15.29)
  vias: v1(54.32,36.75)
BUTTON: length 24.1
  Top Layer w0.254: 48.95,42.87 47.73,42.87 47.2,42.34 41.62,42.34 40.93,41.66 28.77,41.66 28.77,40.8 27.95,39.98 SW1.1
BUZZER_NET: length 25.2
  Top Layer w0.254: U3.32 56.12,39.96 55.08,38.91 42,38.91 40.98,37.9 BUZZER1.1
CLK: length 43.5
  Top Layer w0.254: v1(47.08,49.96) 47.08,49.2 47.81,48.47 48.95,48.47
  Bottom Layer w0.254: v1(47.08,49.96) 46.7,50.34 40.6,50.34 38.44,48.18 16.72,48.18 13.3,51.61 12.03,51.61 10.62,50.21 U4.4
DN: length 11.2
  Top Layer w0.254: D1.1 21.55,23.31 R3.1 ; D1.1 21.33,23.49 20.33,23.49 20.15,23.67 R1.1 ; D1.1 21.53,21.5 21.18,21.15 U5.B7 21.18,19.33 21.42,19.1 21.95,19.1 22.19,19.33 22.19,19.95 U5.A7
DP: length 8
  Top Layer w0.254: 22.19,20.8 21.92,20.8 21.68,20.57 ; 22.19,20.8 22.19,21.51 22.84,22.17 D2.1 22.71,23.42 22.71,24.2 22.95,24.44 R2.1 ; 22.19,20.8 22.45,20.8 22.68,20.57 U5.B6 ; 21.68,20.57 21.68,20.57 21.68,19.95 U5.A6 21.68,20.57
LED1_NET: length 24.2
  Top Layer w0.254: U3.9 56.12,51.97 55.84,52.25 51.9,52.25 51.52,52.63 36.16,52.63 35.27,51.74 R4.1
LED2_B_NET: length 42.1
  Top Layer w0.254: v1(52.03,51.49) 52.12,51.4 U3.14 ; v1(47.2,81.71) R5.2
  Bottom Layer w0.254: v1(47.2,81.71) 47.65,81.27 47.65,66.92 46.82,66.09 46.82,63.3 42.63,59.11 42.63,55.42 45.43,52.63 50.89,52.63 v1(52.03,51.49)
LED2_G_NET: length 41.9
  Top Layer w0.254: U3.10 55.33,50.06 v1(55.33,51.61) ; v1(49.74,79.68) 50,79.43 R8.2
  Bottom Layer w0.254: v1(55.33,51.61) 52.67,54.28 46.06,54.28 44.03,56.31 44.03,58.71 47.94,62.61 47.94,65.43 49.74,67.23 v1(49.74,79.68)
LED2_R_NET: length 41.7
  Top Layer w0.254: U3.13 52.92,51.61 v1(52.92,51.61) ; R7.2 v1(48.6,80.94)
  Bottom Layer w0.254: v1(52.92,51.61) 52.92,52.12 51.65,53.39 45.81,53.39 43.39,55.8 43.39,58.98 47.33,62.92 47.33,65.71 48.6,66.98 v1(48.6,80.94)
LED3_NET: length 15
  Top Layer w0.254: 48.95,43.67 47.39,43.67 46.82,43.1 43.78,43.1 43.01,43.87 R6.1
LED4_NET: length 23.6
  Top Layer w0.254: U3.31 55.33,41.27 55.33,40.18 54.7,39.55 38.95,39.55 35.65,36.25 R9.1
LED5_NET: length 60.3
  Top Layer w0.254: U3.7 59.26,47.67 60.54,48.95 60.54,51.87 59.02,53.39 53.05,53.39 52.54,53.9 44.79,53.9 42.38,56.31 42.38,66.09 43.65,67.36 43.65,71.04 41.24,73.46 27.27,73.46 R10.1
LED6_NET: length 41.4
  Top Layer w0.254: R11.1 42.43,71.04 42.76,71.04 43.14,70.66 43.14,67.87 41.62,66.35 41.62,55.93 44.28,53.26 52.16,53.26 52.67,52.76 58.38,52.76 59.78,51.36 59.78,49.2 59.04,48.47 U3.8
MISO: length 86.3
  Top Layer w0.254: U3.16 50.52,50.84 50.25,51.11 v1(49.62,51.11) ; 6.22,46.66 7.24,45.64 10.88,45.64 14.95,41.58 19.9,41.58 23.84,37.64 23.84,30.4 21.55,28.11 R3.2
  Bottom Layer w0.254: v1(49.62,51.11) 39.2,51.11 37.43,49.33 24.98,49.33 21.3,53.01 12.03,53.01 9.1,50.09 9.1,48.95 9.87,48.18 9.87,47.04 9.23,46.41 6.48,46.41 6.22,46.66
MOSI: length 83.7
  Top Layer w0.254: v1(50.76,51.87) 51.32,51.31 U3.15 ; R2.2 22.95,27.74 24.6,29.39 24.6,37.9 20.15,42.34 15.33,42.34 11.01,46.66 9.19,46.66 8.42,47.42 U4.3
  Bottom Layer w0.254: U4.3 7.71,48.65 7.71,49.96 11.64,53.9 22.44,53.9 26.25,50.09 36.97,50.09 38.75,51.87 v1(50.76,51.87)
RST: length 46.9
  Top Layer w0.254: v1(51.78,46.91) 53.72,44.97 U3.29
  Bottom Layer w0.254: U4.5 16.38,46.91 v1(51.78,46.91)
$1N1666: length 5.9
  Top Layer w0.254: R7.1 48.6,77.39 48.74,77.25 LED2.2
$1N1705: length 7
  Top Layer w0.254: R5.1 47.2,78.28 47.64,77.84 LED2.3
$1N1857: length 4.6
  Top Layer w0.254: R8.1 50,76.12 49.87,76 49.87,72.4 LED2.1
$1N3584: length 2.9
  Top Layer w0.254: R4.2 32.98,51.75 32.98,52.29 33.14,52.45 34.31,52.45 34.53,52.67 34.53,53.25 LED1.1
$1N3623: length 2.9
  Top Layer w0.254: LED3.1 34.56,45.38 34.56,44.81 34.38,44.63 33.11,44.63 32.99,44.51 R6.2
$1N3662: length 2.9
  Top Layer w0.254: R9.2 32.99,36.89 33.11,37.01 34.38,37.01 34.56,37.19 34.56,37.76 LED4.1
$1N3701: length 5.3
  Top Layer w0.254: LED5.2 28.91,67.7 R10.2
$1N3740: length 8.4
  Top Layer w0.254: 36.74,67.66 36.66,67.73 36.66,70.92 38.06,72.31 40.35,72.31 R11.2
$1N12045: length 7
  Top Layer w0.254: U5.B5 23.68,18.26 23.89,18.06 27.61,18.06 R14.2
$1N12054: length 11.7
  Top Layer w0.254: R13.2 28.65,17.7 21.3,17.7 20.68,18.31 U5.A5
$1N16109: length 59.3
  Top Layer w0.254: U3.6 59.22,46.87 60.29,47.93 62.83,47.93 63.39,47.37 63.39,40.87 60.03,37.52 44.92,37.52 44.54,37.14 44.54,16.43 46.49,14.48 CN1.1
$1N16126: length 59.7
  Top Layer w0.254: U3.3 59.18,44.47 60.54,43.1 60.54,40.06 58.71,38.23 44.16,38.23 43.14,37.21 43.14,11.23 45.17,9.2 48.09,9.2 48.49,9.59 CN1.2

## Copper pours and planes (outline as drawn; the poured copper is in the pictures)
GND on Top Layer: -7.91,92 73.11,92 73.11,-0.96 -7.91,-0.96
GND on Bottom Layer: 39.82,26.98 44.54,26.98 44.54,23.55 39.82,23.55
GND on Bottom Layer: -6.26,92.38 67.02,92.38 67.02,-4.39 -6.26,-4.39
VCC on Top Layer: 45.68,37.39 64.6,37.39 64.6,35.99 45.68,35.99
VCC on Bottom Layer: 23.5,19.36 23.5,22.04 24.85,22.04 24.85,12.21 19.01,12.21 19.01,27.1 19.67,27.1 19.67,28.66 20.74,28.66 20.75,27.28 20.28,26.27 20.28,19.36
VCC on Bottom Layer: 41.08,46.46 68.41,46.46 68.41,39.55 53.88,25.02 53.88,9.05 41.08,9.05
VCC on Bottom Layer: 19.01,17.07 65.24,17.07 65.24,-2.23 19.01,-2.23

## Text on the board
Bottom Silkscreen Layer: © bitaggregat GmbH | Frohe Weihnachten / und einen guten Rutsch / wünscht Euch bitaggregat!
